# Altium project CAN_Shield.PrjPcb
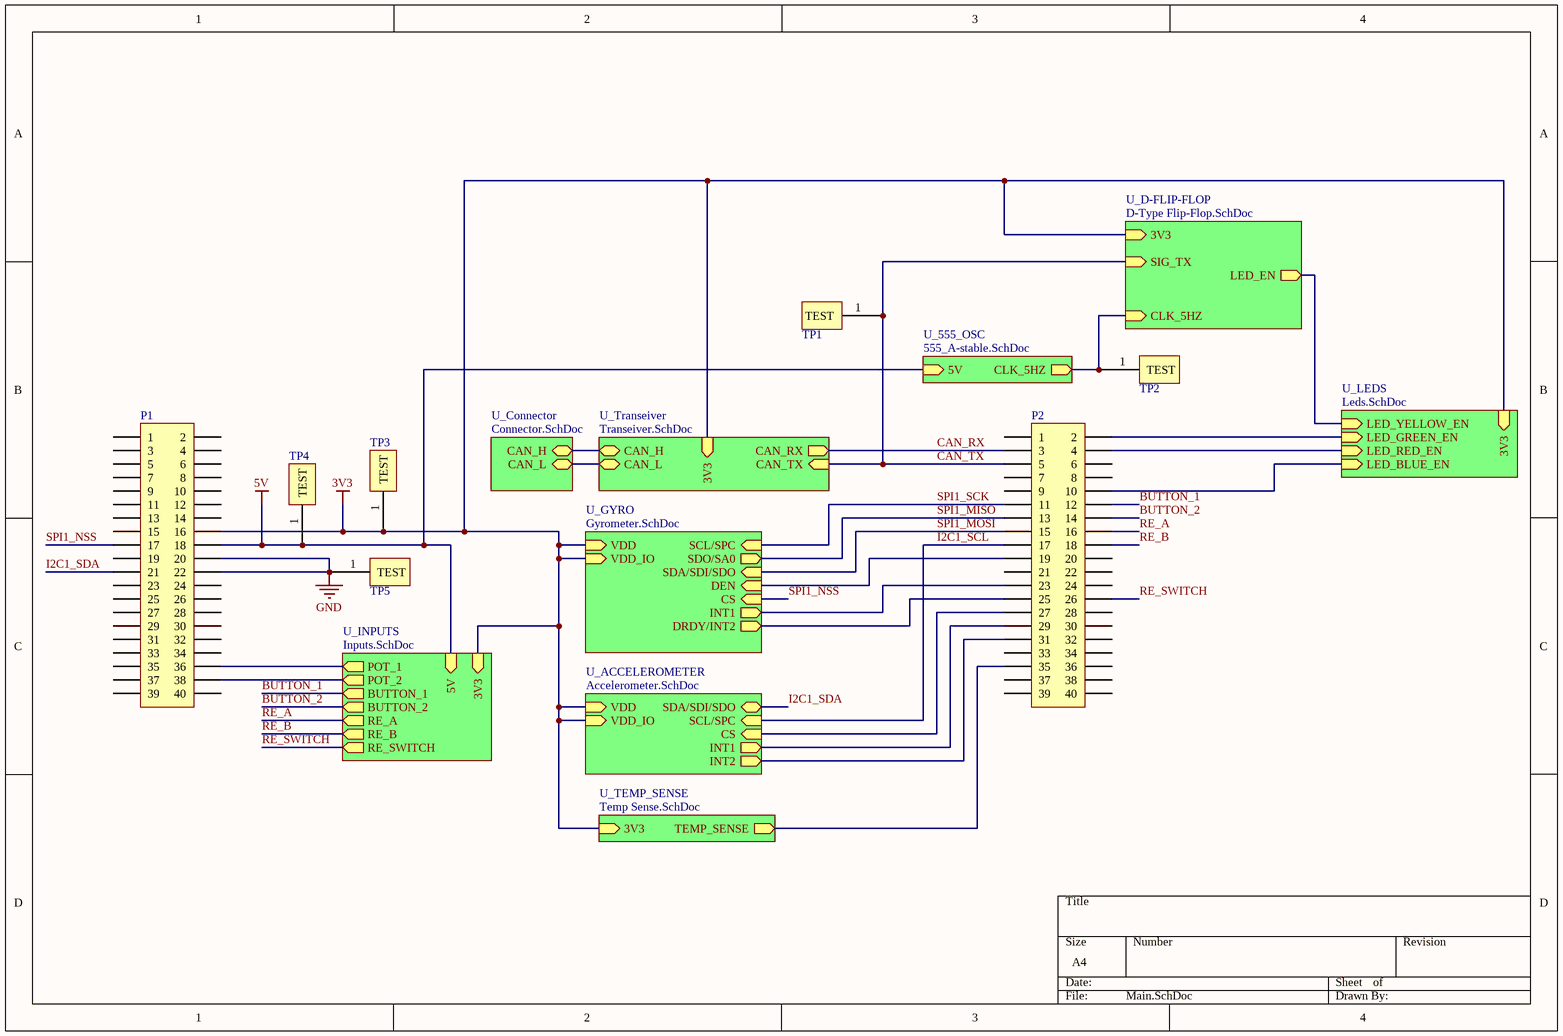
[diagram p0: Main.SchDoc]
10 sheets, 62 parts. Net scope: hierarchical (ports join the sheet entries above them; power ports are global).
Board files: Dev_Board.PcbDoc, Dev_Board_Rev3.PcbDoc, Dev_Board_Rev5.PcbDoc
Sheets:
  Main.SchDoc
    U_Transeiver = Transeiver.SchDoc
    U_Connector = Connector.SchDoc
    U_TEMP_SENSE = Temp Sense.SchDoc
    U_ACCELEROMETER = Accelerometer.SchDoc
    U_GYRO = Gyrometer.SchDoc
    U_LEDS = Leds.SchDoc
    U_INPUTS = Inputs.SchDoc
    U_D-FLIP-FLOP = D-Type Flip-Flop.SchDoc
    U_555_OSC = 555_A-stable.SchDoc

## Sheet Main.SchDoc
size A4

### Parts
P1  Female Header 20x2_BOTTOM  [FEMALE HDR2X20_BOTTOM]  (value not drawn)
P2  Female Header 20x2_BOTTOM  [FEMALE HDR2X20_BOTTOM]  (value not drawn)
TP1  Keystone Electronics 5000  [TEST POINT 5000K]  (value not drawn)
TP2  Keystone Electronics 5000  [TEST POINT 5000K]  (value not drawn)
TP3  Keystone Electronics 5000  [TEST POINT 5000K]  (value not drawn)
TP4  Keystone Electronics 5000  [TEST POINT 5000K]  (value not drawn)
TP5  Keystone Electronics 5000  [TEST POINT 5000K]  (value not drawn)

### Sub-sheets
U_555_OSC = 555_A-stable.SchDoc: CLK_5HZ (out), 5V (in)
U_ACCELEROMETER = Accelerometer.SchDoc: SDA/SDI/SDO (bidir), SCL/SPC (in), CS (in), INT1 (out), INT2 (out), VDD (in), VDD_IO (in)
U_Connector = Connector.SchDoc: CAN_H (bidir), CAN_L (bidir)
U_D-FLIP-FLOP = D-Type Flip-Flop.SchDoc: SIG_TX (in), CLK_5HZ (in), LED_EN (out), 3V3 (in)
U_GYRO = Gyrometer.SchDoc: SCL/SPC (in), SDA/SDI/SDO (in), SDO/SA0 (out), CS (in), DEN (in), INT1 (out), DRDY/INT2 (out), VDD (in), VDD_IO (in)
U_INPUTS = Inputs.SchDoc: BUTTON_1 (out), BUTTON_2 (out), POT_1 (out), POT_2 (out), 3V3 (in), 5V (in), RE_A (out), RE_B (out), RE_SWITCH (out)
U_LEDS = Leds.SchDoc: LED_BLUE_EN (in), LED_GREEN_EN (in), LED_RED_EN (in), LED_YELLOW_EN (in), 3V3 (in)
U_TEMP_SENSE = Temp Sense.SchDoc: TEMP_SENSE (out), 3V3 (in)
U_Transeiver = Transeiver.SchDoc: CAN_L (bidir), CAN_H (bidir), CAN_TX (in), CAN_RX (out), 3V3 (in)

### Nets
3V3: P1.16 TP3.1(TEST) ; sheet U_Transeiver/3V3, sheet U_TEMP_SENSE/3V3, sheet U_ACCELEROMETER/VDD, sheet U_ACCELEROMETER/VDD_IO, sheet U_GYRO/VDD, sheet U_GYRO/VDD_IO, sheet U_LEDS/3V3, sheet U_INPUTS/3V3, sheet U_D-FLIP-FLOP/3V3
5V: P1.18 TP4.1(TEST) ; sheet U_INPUTS/5V, sheet U_555_OSC/5V
GND: P1.20 P1.22 TP5.1(TEST)
BUTTON_1: P2.12 ; sheet U_INPUTS/BUTTON_1
BUTTON_2: P2.14 ; sheet U_INPUTS/BUTTON_2
CAN_RX: P2.3 ; sheet U_Transeiver/CAN_RX
CAN_TX: P2.5 TP1.1(TEST) ; sheet U_Transeiver/CAN_TX, sheet U_D-FLIP-FLOP/SIG_TX
I2C1_SCL: P2.17 ; sheet U_ACCELEROMETER/SCL/SPC
I2C1_SDA: P1.21 ; sheet U_ACCELEROMETER/SDA/SDI/SDO
RE_A: P2.16 ; sheet U_INPUTS/RE_A
RE_B: P2.18 ; sheet U_INPUTS/RE_B
RE_SWITCH: P2.26 ; sheet U_INPUTS/RE_SWITCH
SPI1_MISO: P2.13 ; sheet U_GYRO/SDO/SA0
SPI1_MOSI: P2.15 ; sheet U_GYRO/SDA/SDI/SDO
SPI1_NSS: P1.17 ; sheet U_GYRO/CS
SPI1_SCK: P2.11 ; sheet U_GYRO/SCL/SPC
NetJ1_4: sheet U_Transeiver/CAN_H, sheet U_Connector/CAN_H
NetJ1_5: sheet U_Transeiver/CAN_L, sheet U_Connector/CAN_L
NetO1_4: P2.35 ; sheet U_TEMP_SENSE/TEMP_SENSE
NetP1_36: P1.36 ; sheet U_INPUTS/POT_1
NetP1_38: P1.38 ; sheet U_INPUTS/POT_2
NetP2_2: P2.2 ; sheet U_LEDS/LED_GREEN_EN
NetP2_4: P2.4 ; sheet U_LEDS/LED_RED_EN
NetP2_10: P2.10 ; sheet U_LEDS/LED_BLUE_EN
NetP2_19: P2.19 ; sheet U_GYRO/DEN
NetP2_23: P2.23 ; sheet U_GYRO/INT1
NetP2_25: P2.25 ; sheet U_GYRO/DRDY/INT2
NetP2_27: P2.27 ; sheet U_ACCELEROMETER/CS
NetP2_29: P2.29 ; sheet U_ACCELEROMETER/INT1
NetP2_31: P2.31 ; sheet U_ACCELEROMETER/INT2
NetQ4_G: sheet U_LEDS/LED_YELLOW_EN, sheet U_D-FLIP-FLOP/LED_EN
NetTP2_1: TP2.1(TEST) ; sheet U_D-FLIP-FLOP/CLK_5HZ, sheet U_555_OSC/CLK_5HZ

Not connected (* = marked no-connect by the designer): P1 1 2 3 4 5 6 7 8 9 10 11 12 13 14 15 19 23 24 25 26 27 28 29 30 31 32 33 34 35 37 39 40; P2 1 6 7 8 9 20 21 22 24 28 30 32 33 34 36 37 38 39 40

### Library data of the parts
P1 P2 = Female Header 20x2_BOTTOM: CONN HEADR FMALE 20POS .1" DL AU; Supplier 1: Digi-Key; Supplier Part Number 1: S9197-ND
TP1-TP5 = Keystone Electronics 5000: TEST POINT PC MINI .040"D RED; Mounting Type: 0.040" (1.02mm) Hole Diameter; Type: PC Test Point, Miniature; Supplier 1: Digi-Key; Supplier Part Number 1: 36-5000-ND

## Sheet Transeiver.SchDoc
size A4
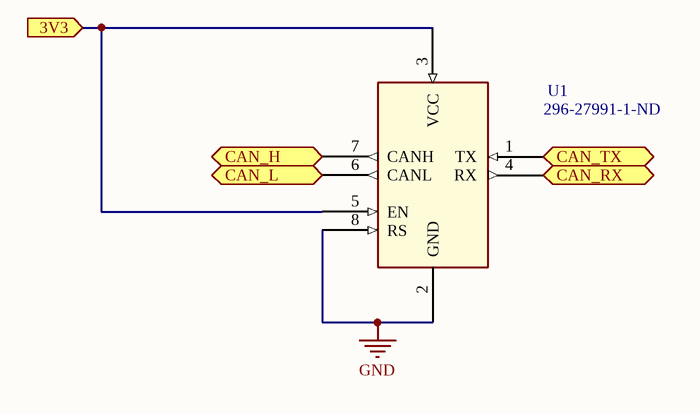
[diagram p1: Transeiver.SchDoc]

### Parts
U1  Supplier Part Number 1: 296-27991-1-ND  [SN65HVD234DR]  (hidden comment: SN65HVD234)

### Ports
3V3 (in), CAN_H (bidir), CAN_L (bidir), CAN_RX (out), CAN_TX (in)

### Nets
3V3: U1.3(VCC) U1.5(EN) ; port 3V3
GND: U1.2(GND) U1.8(RS)
CAN_RX: U1.4(RX) ; port CAN_RX
CAN_TX: U1.1(TX) ; port CAN_TX
NetJ1_4: U1.7(CANH) ; port CAN_H
NetJ1_5: U1.6(CANL) ; port CAN_L

### Library data of the parts
U1 = SN65HVD234: IC CAN TRANSCEIVER 3.3V 8-SOIC; Number of Drivers/Receivers: 1/1; Duplex: Half; Receiver Hysteresis: 100mV; Data Rate: 1Mbps; Voltage - Supply: 3 V ~ 3.6 V; Supplier 1: Digi-Key; Manufacturer Part Number: SN65HVD234DR; Type: Transceiver; Protocol: CAN; Operating Temperature: -40°C ~ 125°C; Package / Case: 8-SOIC

## Sheet Connector.SchDoc
size A4
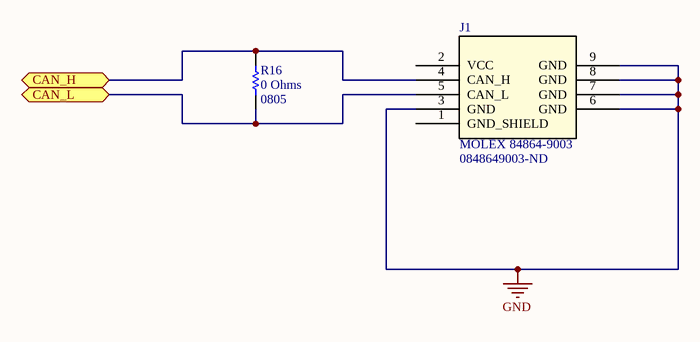
[diagram p2: Connector.SchDoc]

### Parts
J1  MOLEX 84864-9003  Supplier Part Number 1: 0848649003-ND  [MOLEX 84864-9003]
R16  Resistance: 0 Ohms  Package / Case: 0805  [RES0805]  (hidden comment: DNP)

### Ports
CAN_H (bidir), CAN_L (bidir)

### Nets
GND: J1.3(GND) J1.6(GND) J1.7(GND) J1.8(GND) J1.9(GND)
NetJ1_4: J1.4(CAN_H) R16.2 ; port CAN_H
NetJ1_5: J1.5(CAN_L) R16.1 ; port CAN_L

Not connected (* = marked no-connect by the designer): J1 1(GND_SHIELD) 2(VCC)

### Library data of the parts
J1 = MOLEX 84864-9003: CAN Micro-Change M12, Right Angle, Male; Detailed Description: 5 Position Circular Connector Receptacle, Male Pins Solder Gold; Ingress Protection: IP67 - Dust Tight, Waterproof; Voltage - Rated: 250VAC, 250VDC; Current Rating: 4A; Fastening Type: Threaded; Orientation: Keyed; Shell Material, Finish: Brass, Nickel Plated; Contact Finish: Gold; Operating Temperature: -20°C ~ 80°C; Supplier 1: Digi-Key
R16 = DNP: RES SMD 0.0 OHM JUMPER 1/8W 0805; Power (Watts): 0.125W, 1/8W; Supplier 1: Digi-Key; Supplier Part Number 2: 311-0.0ARCT-ND; Tolerance: Jumper

## Sheet Temp Sense.SchDoc
size A
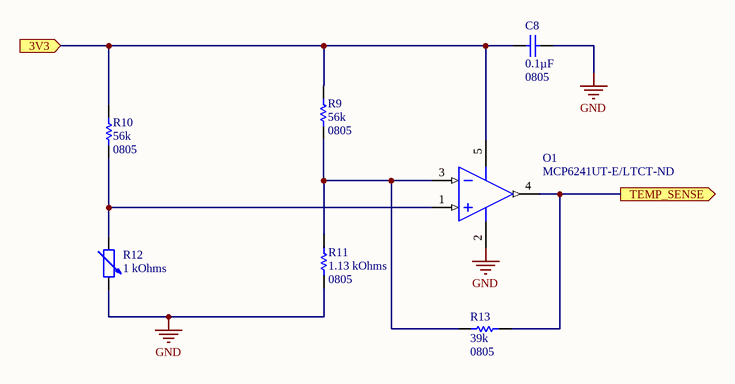
[diagram p3: Temp Sense.SchDoc]

### Parts
C8  Capacitance: 0.1µF  Package / Case: 0805  [CAP0805]  (hidden comment: C0805C104K5RACTU)
O1  Supplier Part Number 1: MCP6241UT-E/LTCT-ND  [MCP6241U]  (hidden comment: MCP6241U)
R9  Resistance: 56k  Package / Case: 0805  [RES0805]  (hidden comment: RC0805FR-0756KL)
R10  Resistance: 56k  Package / Case: 0805  [RES0805]  (hidden comment: RC0805FR-0756KL)
R11  Resistance: 1.13 kOhms  Supplier Device Package: 0805  [RES0805]  (hidden comment: ERJ-6ENF1131V)
R12  Resistance: 1 kOhms  [G-NICO-001]  (hidden comment: G-NICO-001)
R13  Resistance: 39k  Package / Case: 0805  [RES0805]  (hidden comment: RC0805FR-0739KL)

### Ports
3V3 (in), TEMP_SENSE (out)

### Nets
3V3: C8.2 O1.5(V+) R9.2 R10.2 ; port 3V3
GND: C8.1 O1.2(V-) R11.1 R12.2
NetO1_1: O1.1(IN+) R10.1 R12.1
NetO1_3: O1.3(IN-) R9.1 R11.2 R13.1
NetO1_4: O1.4(OUT) R13.2 ; port TEMP_SENSE

### Library data of the parts
C8 = C0805C104K5RACTU: CAP CER 0.1UF 50V X7R 0805; Tolerance: ±10%; Supplier 1: Digi-Key; Supplier Part Number 1: 399-1170-1-ND; Voltage - Rated: 50V; Temperature Coefficient: X7R
O1 = MCP6241U: IC OPAMP GP 550KHZ RRO SC70-5; Amplifier Type: General Purpose; Number of Circuits: 1; Output Type: Rail-to-Rail; Slew Rate: 0.3 V/µs; Current - Input Bias: 1pA; Voltage - Input Offset: 5mV; Current - Supply: 50µA; Current - Output / Channel: 23mA; Voltage - Supply, Single/Dual (±): 1.8 V ~ 5.5 V; Gain Bandwidth Product: 550kHz; -3db Bandwidth: -; Operating Temperature: -40°C ~ 125°C; Package / Case: 5-TSSOP, SC-70-5, SOT-353; Supplier 1: Digi-Key
R9 R10 = RC0805FR-0756KL: RES SMD 56K OHM 1% 1/8W 0805; Power (Watts): 0.125W, 1/8W; Temperature Coefficient: ±100ppm/°C; Tolerance: ±1%; Composition: Thick Film; Features: Moisture Resistant; Operating Temperature: -55°C ~ 155°C; Supplier 1: Digi-Key; Supplier Part Number 1: 311-56.0KCRCT-ND
R11 = ERJ-6ENF1131V: RES SMD 1.13K OHM 1% 1/8W 0805; Detailed Description: ±1% 0.125W, 1/8W Chip Resistor 0805 (2012 Metric) Automotive AEC-Q200 Thick Film; Power (Watts): 0.125W, 1/8W; Tolerance: ±1%; Features: Automotive AEC-Q200; Operating Temperature: -55°C ~ 155°C; Height - Seated (Max): 0.028" (0.70mm); Supplier 1: Digi-Key; Supplier Part Number 1: P1.13KCCT-ND
R12 = G-NICO-001: SENSOR TEMP RTD 1.0K OHM SOT23; Manufacturer: TE Connectivity Measurement Specialties; Current: 5mA; Package / Case: TO-236-3, SC-59, SOT-23-3; Thermistor Type: RTD; Temperature: -55°C ~ 150°C; Supplier 1: Digi-Key; Supplier Part Number 1: 223-1563-1-ND
R13 = RC0805FR-0739KL: RES SMD 39K OHM 1% 1/8W 0805; Power (Watts): 0.125W, 1/8W; Temperature Coefficient: ±100ppm/°C; Tolerance: ±1%; Composition: Thick Film; Features: Moisture Resistant; Operating Temperature: -55°C ~ 155°C; Supplier 1: Digi-Key; Supplier Part Number 1: 311-39.0KCRCT-ND

## Sheet Accelerometer.SchDoc
size A
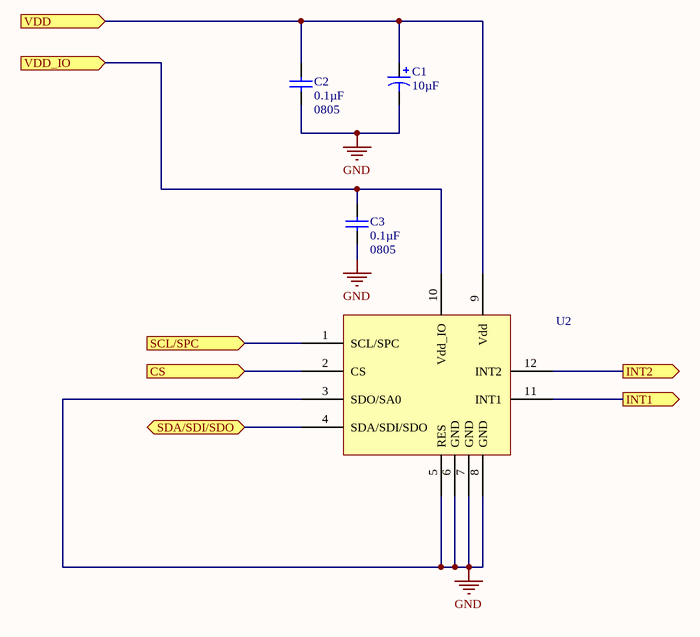
[diagram p4: Accelerometer.SchDoc]

### Parts
C1  Capacitance: 10µF  [Aluminum Cap 875105240001]  (hidden comment: 875105240001)
C2  Capacitance: 0.1µF  Package / Case: 0805  [CAP0805]  (hidden comment: C0805C104K5RACTU)
C3  Capacitance: 0.1µF  Package / Case: 0805  [CAP0805]  (hidden comment: C0805C104K5RACTU)
U2  LIS2HH12TR  [LIS2HH12TR]  (value not drawn)

### Ports
CS (in), INT1 (out), INT2 (out), SCL/SPC (in), SDA/SDI/SDO (bidir), VDD (in), VDD_IO (in)

### Nets
3V3: C1.1 C2.2 C3.2 U2.9(Vdd) U2.10(Vdd_IO) ; port VDD_IO, port VDD
GND: C1.2 C2.1 C3.1 U2.3(SDO/SA0) U2.5(RES) U2.6(GND) U2.7(GND) U2.8(GND)
I2C1_SCL: U2.1(SCL/SPC) ; port SCL/SPC
I2C1_SDA: U2.4(SDA/SDI/SDO) ; port SDA/SDI/SDO
NetP2_27: U2.2(CS) ; port CS
NetP2_29: U2.11(INT1) ; port INT1
NetP2_31: U2.12(INT2) ; port INT2

### Library data of the parts
C1 = 875105240001: CAP ALUM POLY 10UF 20% 10V SMD; Type: Polymer; ESR (Equivalent Series Resistance): 45 mOhm; Lifetime @ Temp.: 2000 Hrs @ 105°C; Ripple Current - Low Frequency: 60mA @ 120Hz; Ripple Current - High Frequency: 1.2A @ 100kHz; Surface Mount Land Size: 0.169" L x 0.169" W (4.30mm x 4.30mm); Tolerance: ±20%; Voltage - Rated: 10V; Operating Temperature: -55°C ~ 105°C; Applications: General Purpose; Size / Dimension: 0.157" Dia (4.00mm); Height - Seated (Max): 0.217" (5.50mm); Package / Case: Radial, Can - SMD; Supplier 1: Digi-Key; Supplier Part Number 1: 732-6401-1-ND
C2 C3 = C0805C104K5RACTU: as C8 on sheet Temp Sense; Supplier 1: Digi-Key; Supplier Part Number 1: 399-1170-1-ND; Voltage - Rated: 50V; Temperature Coefficient: X7R
U2 = LIS2HH12TR: ACCELEROMETER 2-8G I2C/SPI 12LGA; Axis: X, Y, Z; Acceleration Range: ±2g, 4g, 8g; Sensitivity (LSB/g): 16393 (±2g) ~ 4098 (±8g); Bandwidth: 5Hz ~ 400Hz; Output Type: I²C, SPI; 1.71 V ~ 3.6 V: Voltage - Supply; Type: Digital; Features: Adjustable Bandwidth, Selectable Scale, Temperature Sensor; Operating Temperature: -40°C ~ 85°C (TA); Package / Case: 12-VFLGA; Supplier 1: Digi-Key; Supplier Part Number 1: 497-15069-1-ND

## Sheet Gyrometer.SchDoc
size A
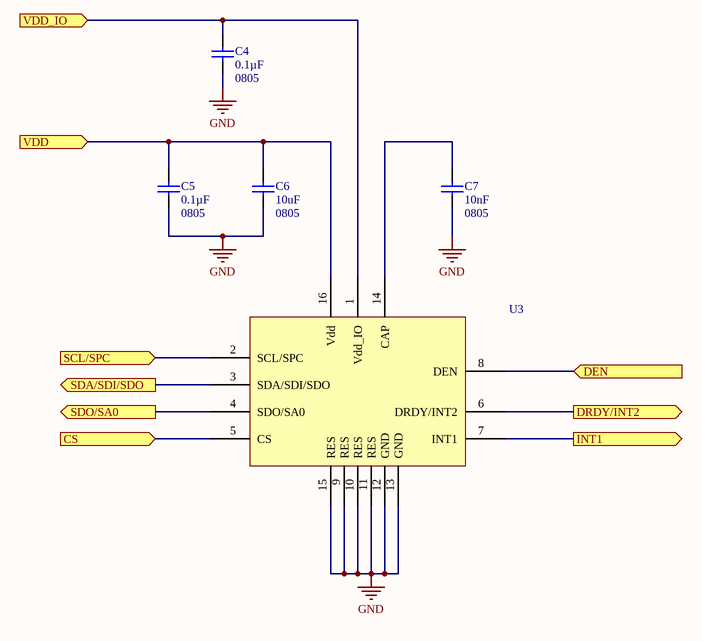
[diagram p5: Gyrometer.SchDoc]

### Parts
C4  Capacitance: 0.1µF  Package / Case: 0805  [CAP0805]  (hidden comment: C0805C104K5RACTU)
C5  Capacitance: 0.1µF  Package / Case: 0805  [CAP0805]  (hidden comment: C0805C104K5RACTU)
C6  Capacitance: 10uF  Package / Case: 0805  [CAP0805]  (hidden comment: C2012JB1V106K125AC)
C7  Capacitance: 10nF  Package / Case: 0805  [CAP0805]  (hidden comment: CGA4C2C0G1H103J060AA)
U3  L3GD20HTR  [L3GD20HTR]  (value not drawn)

### Ports
CS (in), DEN (in), DRDY/INT2 (out), INT1 (out), SCL/SPC (in), SDA/SDI/SDO (out), SDO/SA0 (out), VDD (in), VDD_IO (in)

### Nets
3V3: C4.2 C5.2 C6.2 U3.1(Vdd_IO) U3.16(Vdd) ; port VDD, port VDD_IO
GND: C4.1 C5.1 C6.1 C7.1 U3.9(RES) U3.10(RES) U3.11(RES) U3.12(GND) U3.13(GND) U3.15(RES)
SPI1_MISO: U3.4(SDO/SA0) ; port SDO/SA0
SPI1_MOSI: U3.3(SDA/SDI/SDO) ; port SDA/SDI/SDO
SPI1_NSS: U3.5(CS) ; port CS
SPI1_SCK: U3.2(SCL/SPC) ; port SCL/SPC
NetC7_2: C7.2 U3.14(CAP)
NetP2_19: U3.8(DEN) ; port DEN
NetP2_23: U3.7(INT1) ; port INT1
NetP2_25: U3.6(DRDY/INT2) ; port DRDY/INT2

### Library data of the parts
C4 C5 = C0805C104K5RACTU: as C8 on sheet Temp Sense; Supplier 1: Digi-Key; Supplier Part Number 1: 399-1170-1-ND; Voltage - Rated: 50V; Temperature Coefficient: X7R
C6 = C2012JB1V106K125AC: CAP CER 10UF 35V JB 0805; Tolerance: ±20%; Supplier 1: Digi-Key; Supplier Part Number 1: 445-11517-1-ND; Voltage - Rated: 35V
C7 = CGA4C2C0G1H103J060AA: CAP CER 10000PF 50V C0G 0805; Tolerance: ±5%; Supplier 1: Digi-Key; Supplier Part Number 1: 445-6947-1-ND; Voltage - Rated: 50V; Thickness: 0.7mm; Operating Temperature: -55°C ~ 125°C
U3 = L3GD20HTR: IC MEMS MOTION SENSOR 16LLGA; Manufacturer: STMicroelectronics; Axis: X (Pitch), Y (Roll), Z (Yaw); Range °/s: ±245, 500, 2000; Sensitivity (LSB/(°/s)): 8.75 ~ 70; Bandwidth: 6.25Hz ~ 400Hz; Output Type: I²C, SPI; Voltage - Supply: 2.2 V ~ 3.6 V; Current - Supply: 5mA; Type: Digital; Package / Case: 16-LGA; Operating Temperature: -40°C ~ 85°C (TA); Supplier 1: Digi-Key; Supplier Part Number 1: 497-13931-1-ND

## Sheet Leds.SchDoc
size A
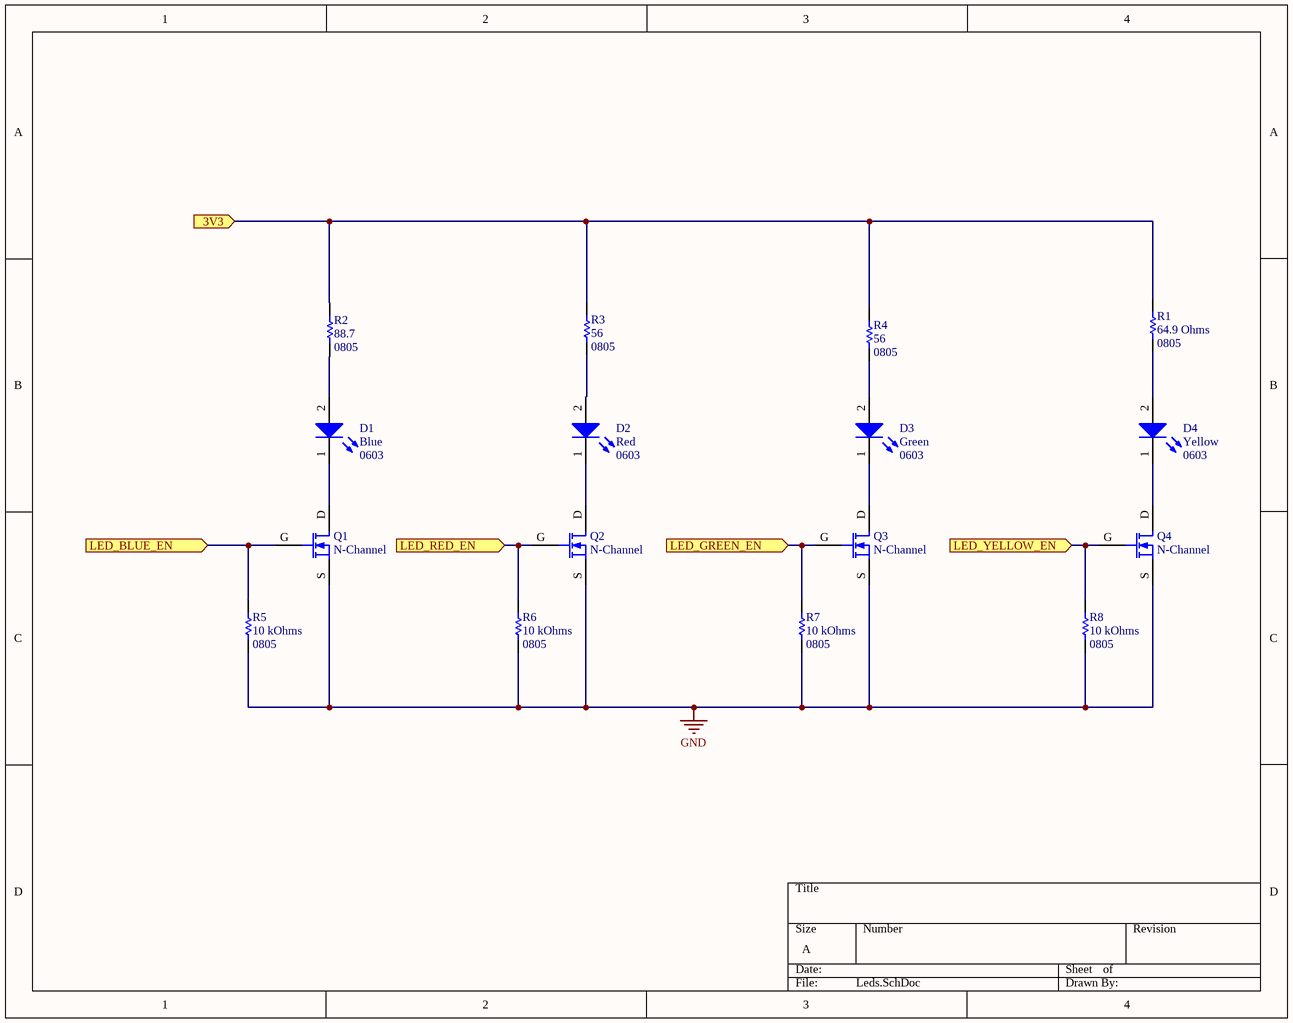
[diagram p6: Leds.SchDoc]

### Parts
D1  Color: Blue  Package / Case: 0603  [SMLE12BC7TT86]  (hidden comment: SMLE12BC7TT86)
D2  Color: Red  Package / Case: 0603  [SML-D12U8WT86]  (hidden comment: SML-D12U8WT86)
D3  Color: Green  Package / Case: 0603  [SML-D12M8WT86]  (hidden comment: SML-D12M8WT86)
D4  Colour: Yellow  Package / Case: 0603  [SML-511WWT86]  (hidden comment: SML-511WWT86)
Q1  FET Type: N-Channel  [2N7002P,215]  (hidden comment: 2N7002P,215)
Q2  FET Type: N-Channel  [2N7002P,215]  (hidden comment: 2N7002P,215)
Q3  FET Type: N-Channel  [2N7002P,215]  (hidden comment: 2N7002P,215)
Q4  FET Type: N-Channel  [2N7002P,215]  (hidden comment: 2N7002P,215)
R1  Resistance: 64.9 Ohms  Package / Case: 0805  [RES0805]  (hidden comment: ERJ-6ENF64R9V)
R2  Resistance: 88.7  Package / Case: 0805  [RES0805]  (hidden comment: CRCW080588R7FKEA)
R3  Resistance (Ohms): 56  Package / Case: 0805  [RES0805]  (hidden comment: RMCF0805JT56R0)
R4  Resistance (Ohms): 56  Package / Case: 0805  [RES0805]  (hidden comment: RMCF0805JT56R0)
R5  Resistance: 10 kOhms  Package / Case: 0805  [RES0805]  (hidden comment: RC0805FR-0710KL)
R6  Resistance: 10 kOhms  Package / Case: 0805  [RES0805]  (hidden comment: RMCF0805FT10K0)
R7  Resistance: 10 kOhms  Package / Case: 0805  [RES0805]  (hidden comment: RMCF0805FT10K0)
R8  Resistance: 10 kOhms  Package / Case: 0805  [RES0805]  (hidden comment: RMCF0805FT10K0)

### Ports
3V3 (in), LED_BLUE_EN (in), LED_GREEN_EN (in), LED_RED_EN (in), LED_YELLOW_EN (in)

### Nets
3V3: R1.2 R2.2 R3.2 R4.2 ; port 3V3
GND: Q1.S Q2.S Q3.S Q4.S R5.1 R6.1 R7.1 R8.1
NetD1_1: D1.1(K) Q1.D
NetD1_2: D1.2(A) R2.1
NetD2_1: D2.1(K) Q2.D
NetD2_2: D2.2(A) R3.1
NetD3_1: D3.1(K) Q3.D
NetD3_2: D3.2(A) R4.1
NetD4_1: D4.1(K) Q4.D
NetD4_2: D4.2(A) R1.1
NetP2_2: Q3.G R7.2 ; port LED_GREEN_EN
NetP2_4: Q2.G R6.2 ; port LED_RED_EN
NetP2_10: Q1.G R5.2 ; port LED_BLUE_EN
NetQ4_G: Q4.G R8.2 ; port LED_YELLOW_EN

### Library data of the parts
D1 = SMLE12BC7TT86: LED BLUE CLEAR 0603 SMD; Lens Color: Colorless; Millicandela Rating: 22mcd; Lens Style/Size: Rectangle with Flat Top, 1.20mm x 0.80mm; Voltage - Forward (Vf) (Typ): 2.9V; Current - Test: 5mA; Wavelength - Dominant: 470nm; Lens Transparency: Clear; Supplier 1: Digi-Key; Supplier Part Number 1: 511-1589-1-ND
D2 = SML-D12U8WT86: LED RED DIFFUSED 0603 SMD; Lens Color: White; Millicandela Rating: 63mcd; Voltage - Forward (Vf) (Typ): 2.2V; Current - Test: 20mA; Wavelength - Dominant: 620nm; Supplier 1: Digi-Key; Supplier Part Number 1: 511-1580-1-ND; Lens Transparency: Diffused
D3 = SML-D12M8WT86: LED GREEN DIFFUSED 0603 SMD; Lens Color: White; Millicandela Rating: 25mcd; Lens Style/Size: Rectangle with Flat Top, 1.20mm x 0.80mm; Voltage - Forward (Vf) (Typ): 2.2V; Current - Test: 20mA; Wavelength - Dominant: 572nm; Lens Transparency: Diffused; Supplier 1: Digi-Key; Supplier Part Number 1: 511-1578-1-ND
D4 = SML-511WWT86: LED YELLOW DIFFUSED 0603 SMD; Detailed Description: Yellow 590nm LED Indication - Discrete 2V 0603 (1608 Metric); Lens Colour: White; Millicandela Rating: 40mcd; Lens Style/Size: Rectangle with Flat Top, 1.20mm x 0.80mm; Voltage - Forward (Vf) (Type): 2V; Current - Test: 20mA; Wavelength - Dominant: 590nm; Lens Transparancy: Diffused; Mounting Type: Surface Mount; Height - Max: 0.65mm; Supplier 1: Digi-Key
Q1-Q4 = 2N7002P,215: MOSFET N-CH 60V 0.36A SOT-23; Current - Continuous Drain (Id) @ 25°C: 360mA (Ta); Drive Voltage (Max Rds On, Min Rds On): 10V; Vgs(th) (Max) @ Id  2.4V @: 250µA; Gate Charge (Qg) (Max) @ Vgs: 0.8nC @ 4.5V; Input Capacitance (Ciss) (Max) @ Vds: 50pF @ 10V; Vgs (Max): ±20V; Power Dissipation (Max): 350mW (Ta); Rds On (Max) @ Id, Vgs: 1.6 Ohm @ 500mA, 10V; Technology: MOSFET (Metal Oxide); Drain to Source Voltage (Vdss): 60V; Package / Case: TO-236-3, SC-59, SOT-23-3; Supplier 1: Digi-Key; Supplier Part Number 1: 1727-4692-1-ND
R1 = ERJ-6ENF64R9V: RES SMD 64.9 OHM 1% 1/8W 0805; Power (Watts): 0.125W, 1/8W; Detailed Description: ±1% 0.125W, 1/8W Chip Resistor 0805 (2012 Metric) Automotive AEC-Q200 Thick Film; Supplier 1: Digi-Key; Supplier Part Number 1: P64.9CCT-ND; Tolerance: ±1%; Features: Automotive AEC-Q200; Operating Temperature: -55°C ~ 155°C; Height - Seated (Max): 0.028" (0.70mm)
R2 = CRCW080588R7FKEA: RES SMD 88.7 OHM 1% 1/8W 0805; Power (Watts): 0.125W, 1/8W; Supplier 1: Digi-Key; Supplier Part Number 1: 541-88.7CCT-ND; Tolerance: ±1%; Operating Temperature: -55°C ~ 155°C
R3 R4 = RMCF0805JT56R0: RES SMD 56 OHM 5% 1/8W 0805; Power (Watts): 0.125W, 1/8W; Supplier 1: Digi-Key; Supplier Part Number 1: RMCF0805JT56R0CT-ND; Composition: Thick Film
R5 = RC0805FR-0710KL: RES SMD 10K OHM 1% 1/8W 0805; Manufacturer: Yageo; Power (Watts): 0.125W, 1/8W; Temperature Coefficient: ±100ppm/°C; Supplier 1: Digi-Key; Supplier Part Number 1: 311-10.0KCRCT-ND; Tolerance: ±1%; Composition: Thick Film; Features: Moisture Resistant; Operating Temperature: -55°C ~ 155°C
R6-R8 = RMCF0805FT10K0: RES SMD 10K OHM 1% 1/8W 0805; Power (Watts): 0.125W, 1/8W; Supplier 1: Digi-Key; Tolerance: ±1%; Features: Automotive AEC-Q200; Height - Seated (Max): 0.026" (0.65mm); Supplier Part Number 1: RMCF0805FT10K0CT-ND

## Sheet Inputs.SchDoc
size A4
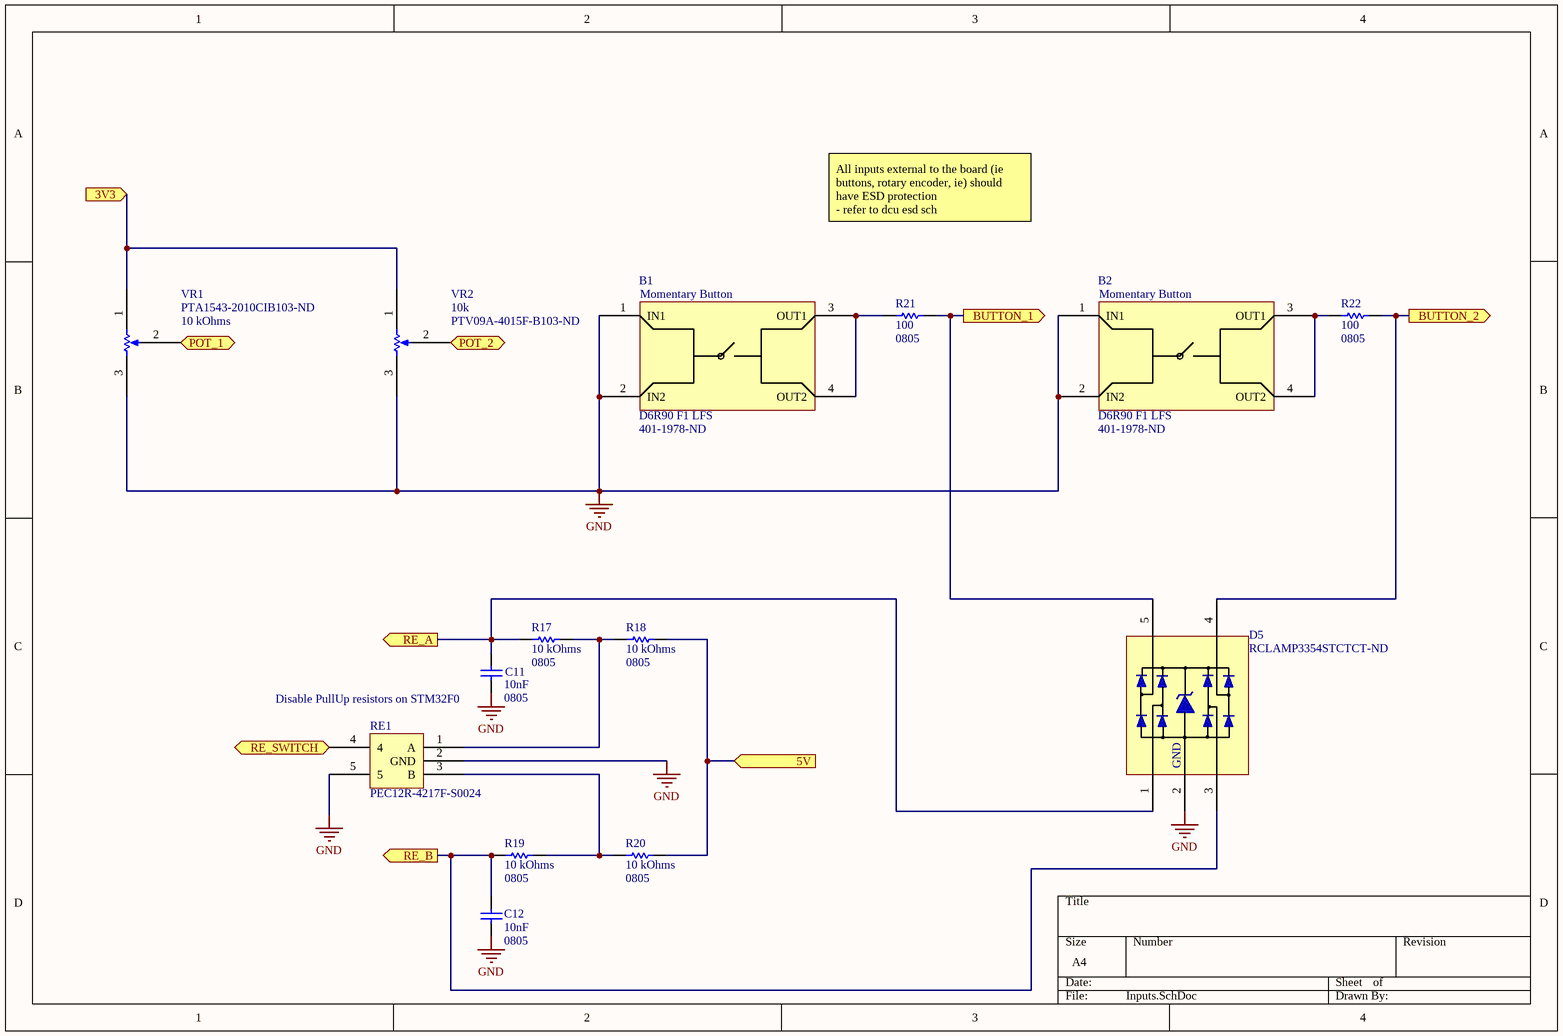
[diagram p7: Inputs.SchDoc]

### Parts
B1  D6R90 F1 LFS  Supplier Part Number 1: 401-1978-ND  [MomentaryButton]
B2  D6R90 F1 LFS  Supplier Part Number 1: 401-1978-ND  [MomentaryButton]
C11  Capacitance: 10nF  Package / Case: 0805  [CAP0805]  (hidden comment: CGA4C2C0G1H103J060AA)
C12  Capacitance: 10nF  Package / Case: 0805  [CAP0805]  (hidden comment: CGA4C2C0G1H103J060AA)
D5  Supplier Part Number 1: RCLAMP3354STCTCT-ND  [SOT95P280X145-5N]  (hidden comment: RCLAMP3354S.TCT)
R17  Resistance: 10 kOhms  Package / Case: 0805  [RES0805]  (hidden comment: RC0805FR-0710KL)
R18  Resistance: 10 kOhms  Package / Case: 0805  [RES0805]  (hidden comment: RC0805FR-0710KL)
R19  Resistance: 10 kOhms  Package / Case: 0805  [RES0805]  (hidden comment: RC0805FR-0710KL)
R20  Resistance: 10 kOhms  Package / Case: 0805  [RES0805]  (hidden comment: RC0805FR-0710KL)
R21  Resistance (Ohms): 100  Package / Case: 0805  [RES0805]  (hidden comment: RC0805FR-07100RL)
R22  Resistance (Ohms): 100  Package / Case: 0805  [RES0805]  (hidden comment: RC0805FR-07100RL)
RE1  PEC12R-4217F-S0024  [Bourns Inc. PEC12R-4217F-S0024]
VR1  Supplier Part Number 1: PTA1543-2010CIB103-ND  Resistance: 10 kOhms  [PTA1543-2010CIB103]  (hidden comment: PTA1543-2010CIB103)
VR2  Resistance (Ohms): 10k  Supplier Part Number 1: PTV09A-4015F-B103-ND  [PTV09A-4015F-B103]  (hidden comment: PTV09A-4015F-B103)

### Ports
3V3 (in), 5V (in), BUTTON_1 (out), BUTTON_2 (out), POT_1 (out), POT_2 (out), RE_A (out), RE_B (out), RE_SWITCH (out)

### Nets
3V3: VR1.1 VR2.1 ; port 3V3
5V: R18.1 R20.2 ; port 5V
GND: B1.1(IN1) B1.2(IN2) B2.1(IN1) B2.2(IN2) C11.2 C12.1 D5.2(GND) RE1.2(GND) RE1.5 VR1.3 VR2.3
BUTTON_1: D5.5 R21.2 ; port BUTTON_1
BUTTON_2: D5.4 R22.2 ; port BUTTON_2
RE_A: C11.1 D5.1 R17.2 ; port RE_A
RE_B: C12.2 D5.3 R19.2 ; port RE_B
RE_SWITCH: RE1.4 ; port RE_SWITCH
NetB1_3: B1.3(OUT1) B1.4(OUT2) R21.1
NetB2_3: B2.3(OUT1) B2.4(OUT2) R22.1
NetP1_36: VR1.2 ; port POT_1
NetP1_38: VR2.2 ; port POT_2
NetR17_1: R17.1 R18.2 RE1.1(A)
NetR19_1: R19.1 R20.1 RE1.3(B)

### Notes on the sheet
- All inputs external to the board (ie buttons, rotary encoder, ie) should have ESD protection
  - refer to dcu esd sch
- (near C11) Disable PullUp resistors on STM32F0
- (in symbol D6R90 F1 LFS) Momentary Button

### Library data of the parts
B1 B2 = D6R90 F1 LFS: SWITCH PUSH SPST-NO 0.1A 32V; Detailed Description: Pushbutton Switch SPST-NO Keyswitch Through Hole; Switch Function: Off-Mom; Current Rating: 100ma (DC); Electrical Life: 250,000 Cycles; Voltage Rating - DC: 32V; Mounting Type: Through Hole; Supplier 1: Digi-Key
C11 C12 = CGA4C2C0G1H103J060AA: as C7 on sheet Gyrometer; Supplier 1: Digi-Key; Supplier Part Number 1: 445-6947-1-ND; Voltage - Rated: 50V; Thickness: 0.7mm; Operating Temperature: -55°C ~ 125°C
D5 = RCLAMP3354S.TCT: TVS DIODE 3.3VWM 16VC; Supplier 1: Digi-Key
R17-R20 = RC0805FR-0710KL: as R5 on sheet Leds; Supplier 1: Digi-Key; Supplier Part Number 1: 311-10.0KCRCT-ND; Tolerance: ±1%; Composition: Thick Film; Features: Moisture Resistant; Operating Temperature: -55°C ~ 155°C
R21 R22 = RC0805FR-07100RL: RES SMD 100 OHM 1% 1/8W 0805; Power (Watts): 0.125W, 1/8W; Tolerance: ±1%; Composition: Thick Film; Supplier 1: Digi-Key; Supplier Part Number 1: 311-100CRCT-ND
RE1 = PEC12R-4217F-S0024: ENCODER ROTARY; Encoder Type: Mechanical; Output Type: Quadrature (Incremental); Pulses per Revolution: 24; Actuator Type: 6mm Dia Flatted End; Detent: Yes; Rotational Life (Cycles Min): 30K; Supplier 1: Digi-Key; Supplier Part Number 1: PEC12R-4217F-S0024-ND; Voltage - Supply: -; Built in Switch: Yes; Mounting Type: PCB, Through Hole; Orientation: Vertical
VR1 = PTA1543-2010CIB103: POT SLIDE 10K OHM .05W 15MM; Detailed Description: 0.05W, 1/20W Through Hole Slide Potentiometer Top Adjustment Type; Power (Watts): 0.05W, 1/20W; Tolerance: ±20%; Fader Type: Standard; Supplier 1: Digi-Key; Travel Range: 15mm; Mounting Type: Through Hole
VR2 = PTV09A-4015F-B103: POT 10K OHM 1/20W CARBON LINEAR; Detailed Description: 10k Ohm Gang Linear Through Hole, Snap In Potentiometer None 1 Turn Carbon 0.05W, 1/20W PC Pins, Board Locks; Tolerance: ±20%; Power (Watts): 0.05W, 1/20W; Built in Switch: None; Rotation: 280°; Supplier 1: Digi-Key; Mounting Type: Through Hole, Snap In; Termination Style: PC Pins, Board locks

## Sheet D-Type Flip-Flop.SchDoc
size A4
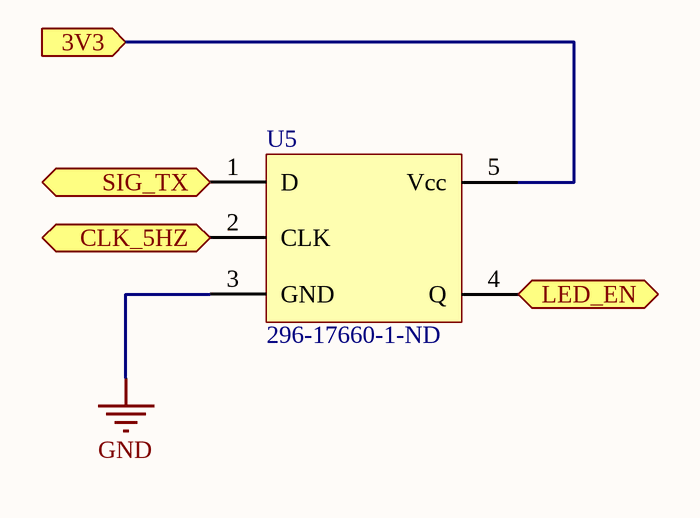
[diagram p8: D-Type Flip-Flop.SchDoc]

### Parts
U5  Supplier Part Number 1: 296-17660-1-ND  [SOT65P210X110-5N]  (hidden comment: SN74AUP1G79DCKR)

### Ports
3V3 (in), CLK_5HZ (in), LED_EN (out), SIG_TX (in)

### Nets
3V3: U5.5(Vcc) ; port 3V3
GND: U5.3(GND)
CAN_TX: U5.1(D) ; port SIG_TX
NetQ4_G: U5.4(Q) ; port LED_EN
NetTP2_1: U5.2(CLK) ; port CLK_5HZ

### Library data of the parts
U5 = SN74AUP1G79DCKR: IC D-TYPE POS TRG SNGL SC70-5; Output Type: Non-Inverted; Number of Elements: 1; Clock Frequency: 266MHz; Max Propagation Delay @ V, Max CL: 5.8ns @ 3.3V, 30pF; Trigger Type: Positive Edge; Voltage - Supply: 0.8 V ~ 3.6 V; Current - Quiescent (Iq): 500nA; Input Capacitance: 1.5pF; Supplier 1: Digi-Key; Type: D-Type; Number of Bits per Element: 1; Operating Temperature: -40°C ~ 85°C (TA); Package / Case: 5-TSSOP, SC-70-5, SOT-353

## Sheet 555_A-stable.SchDoc
size A4
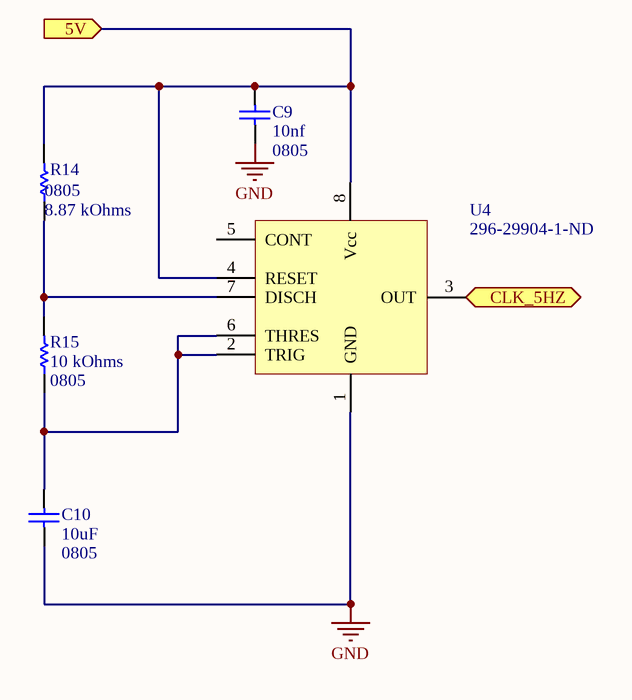
[diagram p9: 555_A-stable.SchDoc]

### Parts
C9  Capacitance: 10nf  Package / Case: 0805  [CAP0805]  (hidden comment: CGA4C2C0G1H103J060AA)
C10  Capacitance: 10uF  Package / Case: 0805  [CAP0805]  (hidden comment: C2012JB1V106K125AC)
R14  Package / Case: 0805  Resistance: 8.87 kOhms  [RES0805]  (hidden comment: ERJ-6ENF8871V)
R15  Resistance: 10 kOhms  Package / Case: 0805  [RES0805]  (hidden comment: RC0805FR-0710KL)
U4  Supplier Part Number 1: 296-29904-1-ND  [TSOP65P650X120-8N]  (hidden comment: NE555PWR)

### Ports
5V (in), CLK_5HZ (out)

### Nets
5V: C9.2 R14.2 U4.4(RESET) U4.8(Vcc) ; port 5V
GND: C9.1 C10.1 U4.1(GND)
NetC10_2: C10.2 R15.1 U4.2(TRIG) U4.6(THRES)
NetR14_1: R14.1 R15.2 U4.7(DISCH)
NetTP2_1: U4.3(OUT) ; port CLK_5HZ

Not connected (* = marked no-connect by the designer): U4 5(CONT)

### Library data of the parts
C9 = CGA4C2C0G1H103J060AA: as C7 on sheet Gyrometer; Supplier 1: Digi-Key; Supplier Part Number 1: 445-6947-1-ND; Voltage - Rated: 50V; Thickness: 0.7mm; Operating Temperature: -55°C ~ 125°C
C10 = C2012JB1V106K125AC: as C6 on sheet Gyrometer; Supplier 1: Digi-Key; Supplier Part Number 1: 445-11517-1-ND; Voltage - Rated: 35V
R14 = ERJ-6ENF8871V: RES SMD 8.87K OHM 1% 1/8W 0805; Power (Watts): 0.125W, 1/8W; Supplier 1: Digi-Key; Tolerance: ±1%; Features: Automotive AEC-Q200; Operating Temperature: -55°C ~ 155°C; Height - Seated (Max): 0.028" (0.70mm)
R15 = RC0805FR-0710KL: as R5 on sheet Leds; Supplier 1: Digi-Key; Supplier Part Number 1: 311-10.0KCRCT-ND; Tolerance: ±1%; Composition: Thick Film; Features: Moisture Resistant; Operating Temperature: -55°C ~ 155°C
U4 = NE555PWR: IC OSC SGL TIMER 100KHZ 8TSSOP; Detailed Description: 555 Type, Timer/Oscillator (Single) IC 100kHz 8-TSSOP; Voltage - Supply: 4.5 V ~ 16 V; Current - Supply: 10mA; Supplier 1: Digi-Key; Type: 555 Type, Timer/Oscillator (Single); Operating Temperature: 0°C ~ 70°C; Package / Case: 8-TSSOP (0.173", 4.40mm Width); Mounting Type: Surface Mount; Frequency: 100kHz

## Nets that join several sheets
3V3: Main (P1.16 TP3.1), Transeiver (U1.3 U1.5), Temp Sense (C8.2 O1.5 R9.2 R10.2), Accelerometer (5 pins), Gyrometer (5 pins), Leds (R1.2 R2.2 R3.2 R4.2), Inputs (VR1.1 VR2.1), D-Type Flip-Flop (U5.5)
5V: Main (P1.18 TP4.1), Inputs (R18.1 R20.2), 555_A-stable (C9.2 R14.2 U4.4 U4.8)
GND: Main (P1.20 P1.22 TP5.1), Transeiver (U1.2 U1.8), Connector (5 pins), Temp Sense (C8.1 O1.2 R11.1 R12.2), Accelerometer (8 pins), Gyrometer (10 pins), Leds (8 pins), Inputs (11 pins), D-Type Flip-Flop (U5.3), 555_A-stable (C9.1 C10.1 U4.1)
BUTTON_1: Main (P2.12), Inputs (D5.5 R21.2)
BUTTON_2: Main (P2.14), Inputs (D5.4 R22.2)
CAN_RX: Main (P2.3), Transeiver (U1.4)
CAN_TX: Main (P2.5 TP1.1), Transeiver (U1.1), D-Type Flip-Flop (U5.1)
I2C1_SCL: Main (P2.17), Accelerometer (U2.1)
I2C1_SDA: Main (P1.21), Accelerometer (U2.4)
NetJ1_4: Transeiver (U1.7), Connector (J1.4 R16.2)
NetJ1_5: Transeiver (U1.6), Connector (J1.5 R16.1)
NetO1_4: Main (P2.35), Temp Sense (O1.4 R13.2)
NetP1_36: Main (P1.36), Inputs (VR1.2)
NetP1_38: Main (P1.38), Inputs (VR2.2)
NetP2_2: Main (P2.2), Leds (Q3.G R7.2)
NetP2_4: Main (P2.4), Leds (Q2.G R6.2)
NetP2_10: Main (P2.10), Leds (Q1.G R5.2)
NetP2_19: Main (P2.19), Gyrometer (U3.8)
NetP2_23: Main (P2.23), Gyrometer (U3.7)
NetP2_25: Main (P2.25), Gyrometer (U3.6)
NetP2_27: Main (P2.27), Accelerometer (U2.2)
NetP2_29: Main (P2.29), Accelerometer (U2.11)
NetP2_31: Main (P2.31), Accelerometer (U2.12)
NetQ4_G: Leds (Q4.G R8.2), D-Type Flip-Flop (U5.4)
NetTP2_1: Main (TP2.1), D-Type Flip-Flop (U5.2), 555_A-stable (U4.3)
RE_A: Main (P2.16), Inputs (C11.1 D5.1 R17.2)
RE_B: Main (P2.18), Inputs (C12.2 D5.3 R19.2)
RE_SWITCH: Main (P2.26), Inputs (RE1.4)
SPI1_MISO: Main (P2.13), Gyrometer (U3.4)
SPI1_MOSI: Main (P2.15), Gyrometer (U3.3)
SPI1_NSS: Main (P1.17), Gyrometer (U3.5)
SPI1_SCK: Main (P2.11), Gyrometer (U3.2)